# Altium schematic sheet Sheet1.SchDoc
size E
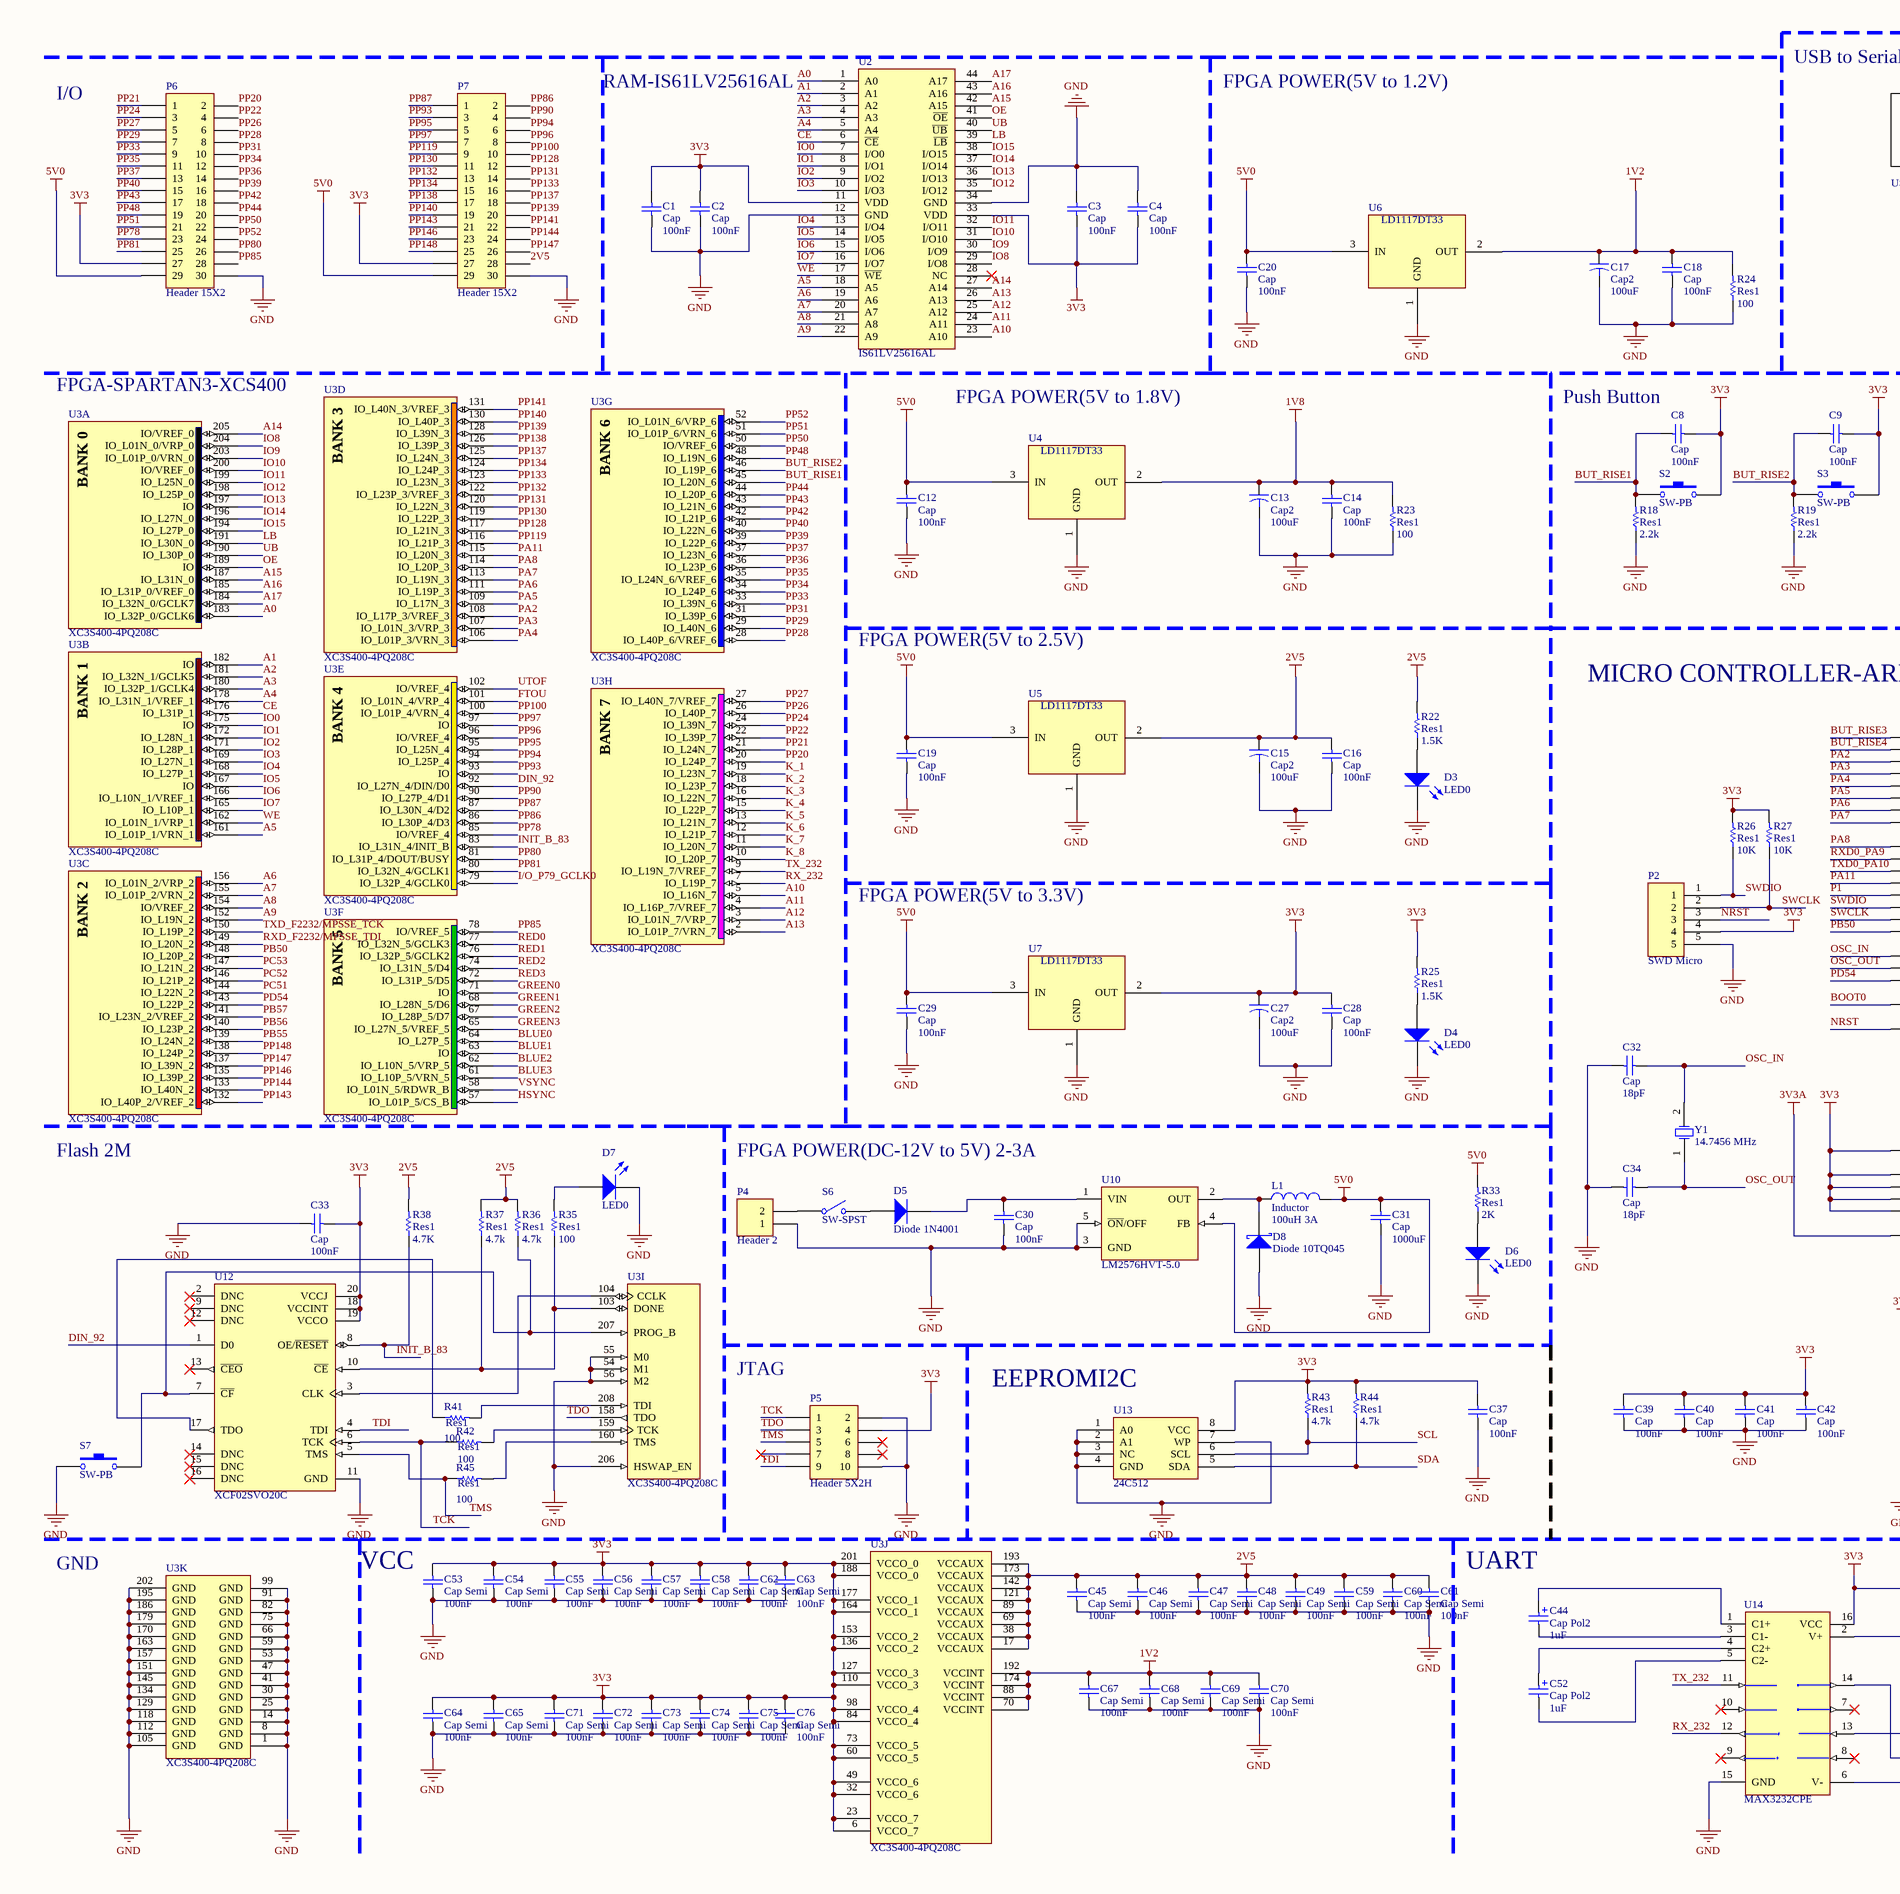
[diagram p0: Sheet1.SchDoc, left]
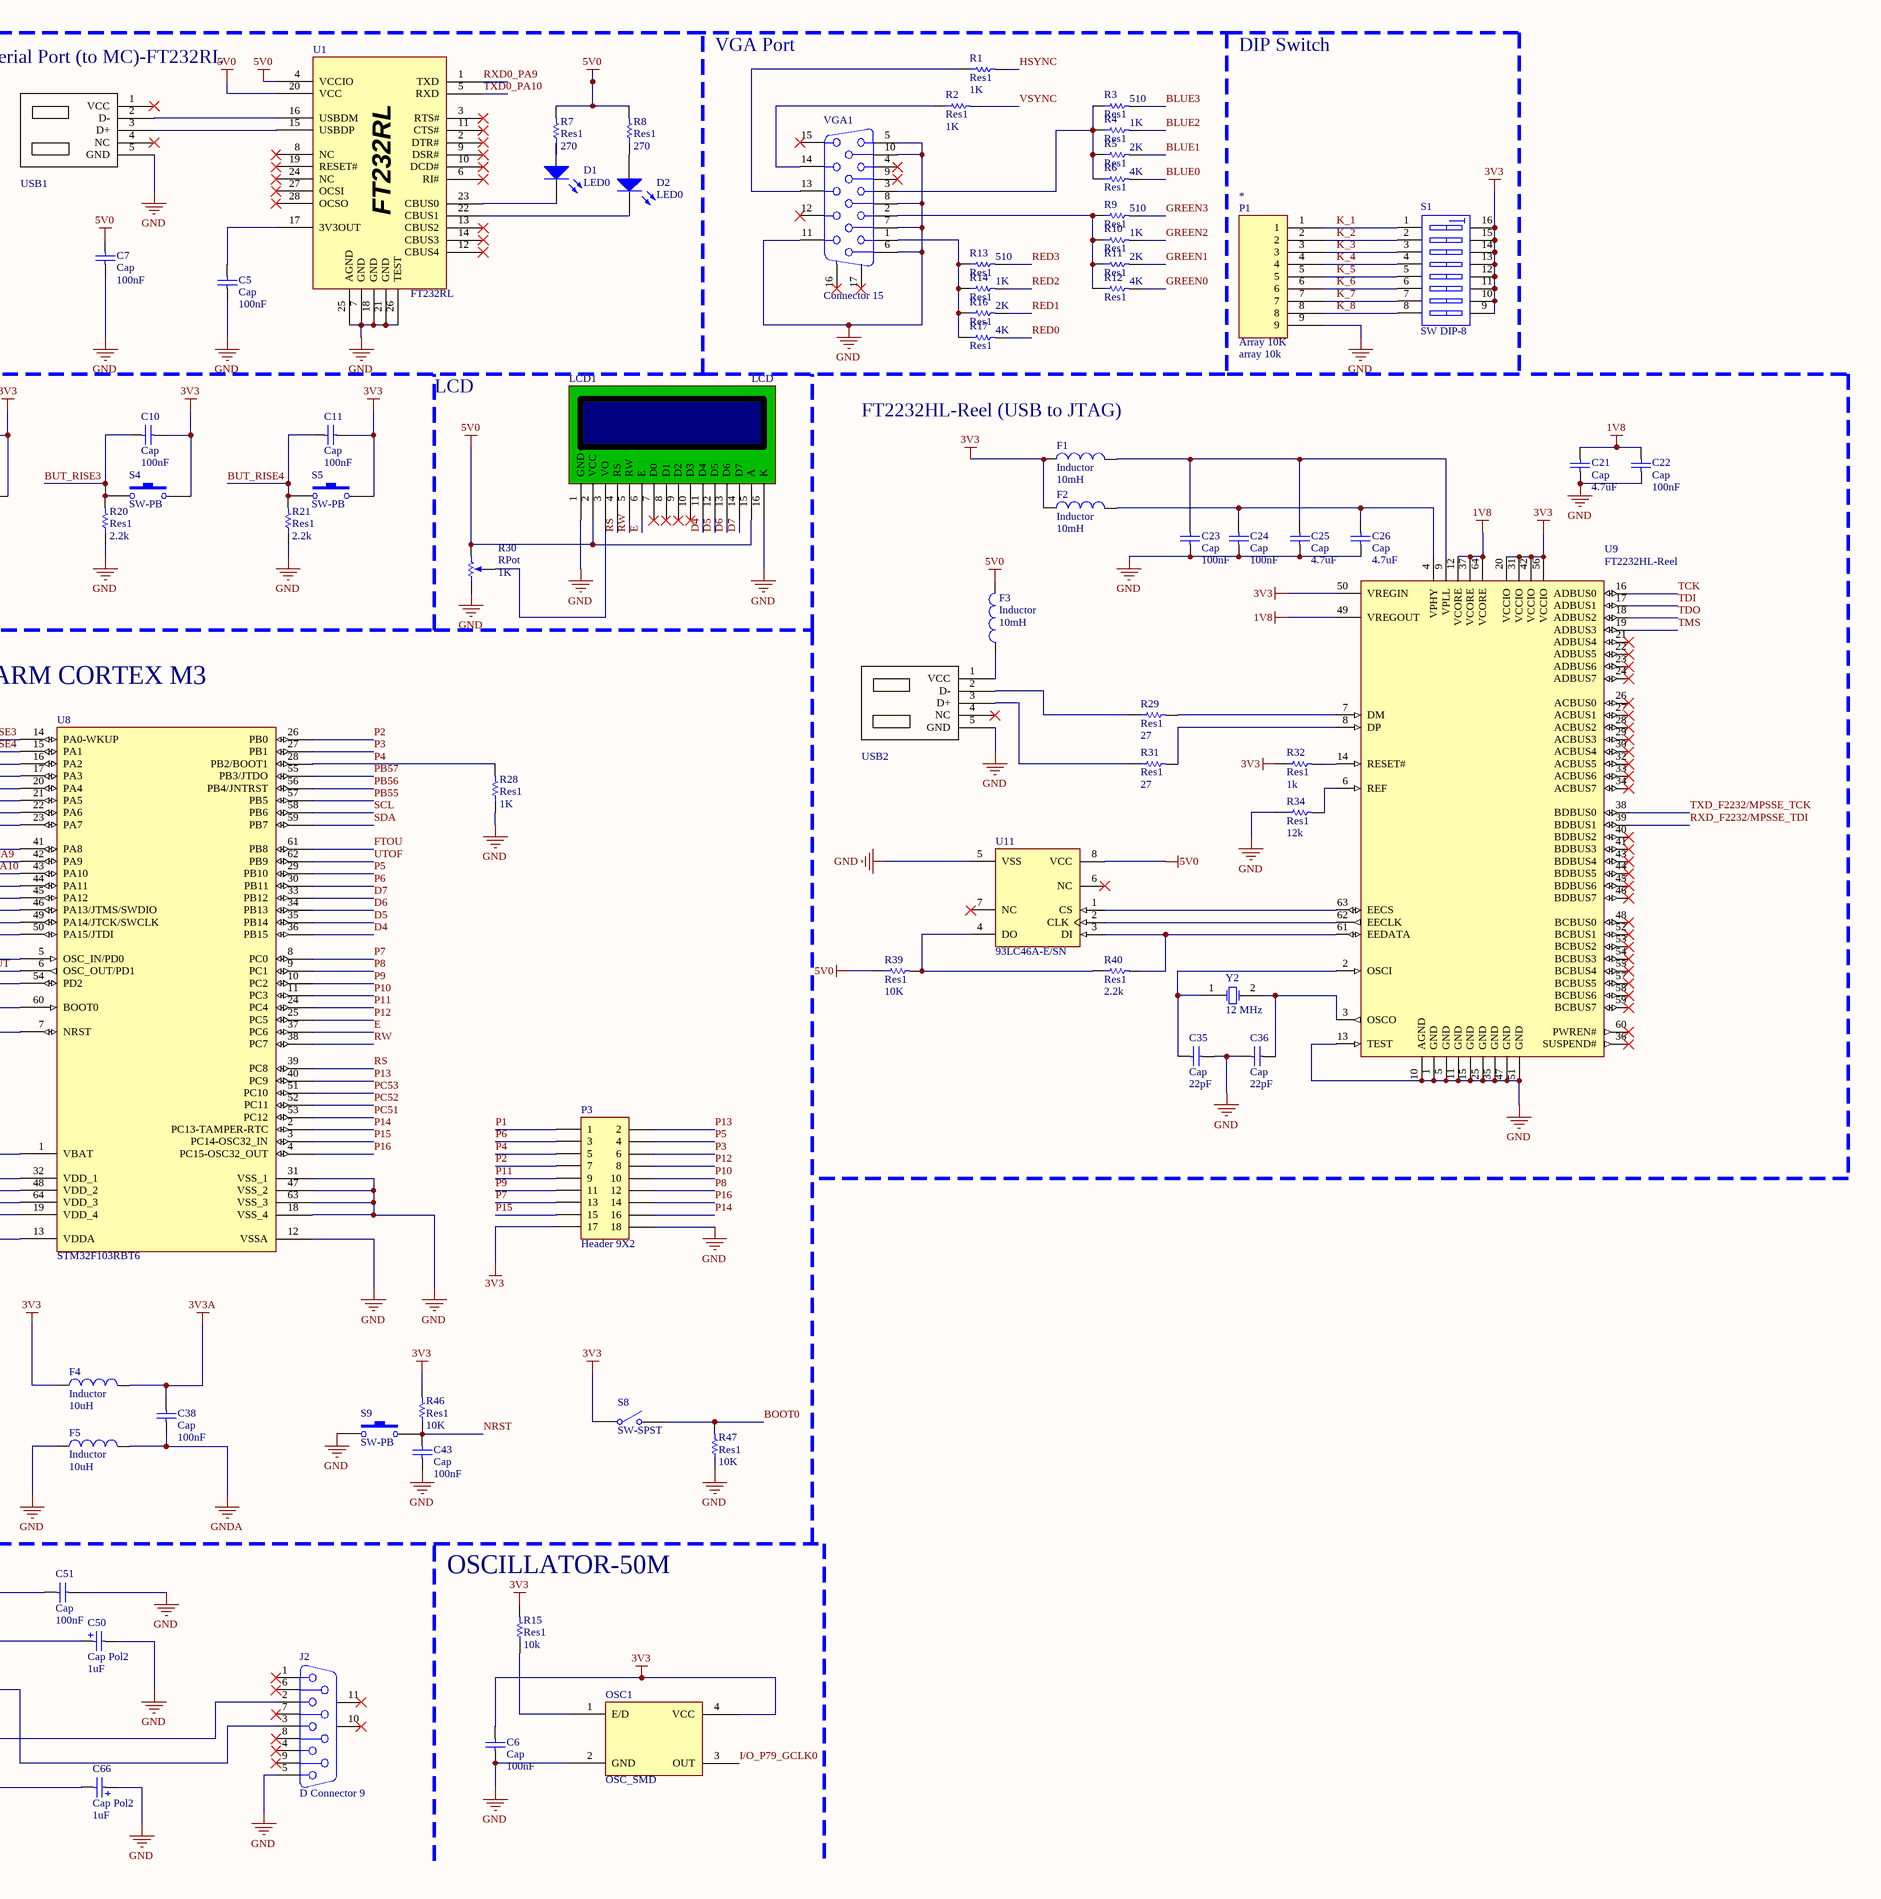
[diagram p1: Sheet1.SchDoc, right]

## Parts
*  array 10k  [Aray 9]
C1  Cap  value 100nF  [SMD_805]
C2  Cap  value 100nF  [SMD_805]
C3  Cap  value 100nF  [SMD_805]
C4  Cap  value 100nF  [SMD_805]
C5  Cap  value 100nF  [SMD_805]
C6  Cap  value 100nF  [SMD_805]
C7  Cap  value 100nF  [SMD_805]
C8  Cap  value 100nF  [SMD_805]
C9  Cap  value 100nF  [SMD_805]
C10  Cap  value 100nF  [SMD_805]
C11  Cap  value 100nF  [SMD_805]
C12  Cap  value 100nF  [SMD_805]
C13  Cap2  value 100uF  [C_B]
C14  Cap  value 100nF  [SMD_805]
C15  Cap2  value 100uF  [C_B]
C16  Cap  value 100nF  [SMD_805]
C17  Cap2  value 100uF  [C_B]
C18  Cap  value 100nF  [SMD_805]
C19  Cap  value 100nF  [SMD_805]
C20  Cap  value 100nF  [SMD_805]
C21  Cap  value 4.7uF  [SMD_805]
C22  Cap  value 100nF  [SMD_805]
C23  Cap  value 100nF  [SMD_805]
C24  Cap  value 100nF  [SMD_805]
C25  Cap  value 4.7uF  [SMD_805]
C26  Cap  value 4.7uF  [SMD_805]
C27  Cap2  value 100uF  [C_B]
C28  Cap  value 100nF  [SMD_805]
C29  Cap  value 100nF  [SMD_805]
C30  Cap  value 100nF  [C_CYL_SMD2]
C31  Cap  value 1000uF  [C_CYL_SMD]
C32  Cap  value 18pF  [SMD_805]
C33  Cap  value 100nF  [SMD_805]
C34  Cap  value 18pF  [SMD_805]
C35  Cap  value 22pF  [SMD_805]
C36  Cap  value 22pF  [SMD_805]
C37  Cap  value 100nF  [SMD_805]
C38  Cap  value 100nF  [SMD_805]
C39  Cap  value 100nF  [SMD_805]
C40  Cap  value 100nF  [SMD_805]
C41  Cap  value 100nF  [SMD_805]
C42  Cap  value 100nF  [SMD_805]
C43  Cap  value 100nF  [SMD_805]
C44  Cap Pol2  value 1uF  [C_B]
C45  Cap Semi  value 100nF  [SMD_805]
C46  Cap Semi  value 100nF  [SMD_805]
C47  Cap Semi  value 100nF  [SMD_805]
C48  Cap Semi  value 100nF  [SMD_805]
C49  Cap Semi  value 100nF  [SMD_805]
C50  Cap Pol2  value 1uF  [C_B]
C51  Cap  value 100nF  [SMD_805]
C52  Cap Pol2  value 1uF  [C_B]
C53  Cap Semi  value 100nF  [SMD_805]
C54  Cap Semi  value 100nF  [SMD_805]
C55  Cap Semi  value 100nF  [SMD_805]
C56  Cap Semi  value 100nF  [SMD_805]
C57  Cap Semi  value 100nF  [SMD_805]
C58  Cap Semi  value 100nF  [SMD_805]
C59  Cap Semi  value 100nF  [SMD_805]
C60  Cap Semi  value 100nF  [SMD_805]
C61  Cap Semi  value 100nF  [SMD_805]
C62  Cap Semi  value 100nF  [SMD_805]
C63  Cap Semi  value 100nF  [SMD_805]
C64  Cap Semi  value 100nF  [SMD_805]
C65  Cap Semi  value 100nF  [SMD_805]
C66  Cap Pol2  value 1uF  [C_B]
C67  Cap Semi  value 100nF  [SMD_805]
C68  Cap Semi  value 100nF  [SMD_805]
C69  Cap Semi  value 100nF  [SMD_805]
C70  Cap Semi  value 100nF  [SMD_805]
C71  Cap Semi  value 100nF  [SMD_805]
C72  Cap Semi  value 100nF  [SMD_805]
C73  Cap Semi  value 100nF  [SMD_805]
C74  Cap Semi  value 100nF  [SMD_805]
C75  Cap Semi  value 100nF  [SMD_805]
C76  Cap Semi  value 100nF  [SMD_805]
D1  LED0  [SMD_805]
D2  LED0  [SMD_805]
D3  LED0  [SMD_805]
D4  LED0  [SMD_805]
D5  Diode 1N4001  [TVS]
D6  LED0  [SMD_805]
D7  LED0  [SMD_805]
D8  Diode 10TQ045  [1N5822]
F1  Inductor  value 10mH  [SMD_805]
F2  Inductor  value 10mH  [SMD_805]
F3  Inductor  value 10mH  [SMD_805]
F4  Inductor  value 10uH  [SMD_805]
F5  Inductor  value 10uH  [SMD_805]
J2  D Connector 9  [COM_3d]
L1  Inductor  value 100uH 3A  [INDUC_SMD]
LCD1  LCD  [LCD2x16_3d]
OSC1  OSC_SMD  [OSC_SMD]
P2  P  [H5]  (value not drawn)
P3  Header 9X2  [HDR2X9]
P4  Header 2  [ADAP_JACK]
P5  Header 5X2H  [BOX2x5_3D]
P6  Header 15X2  [HDR2X15]
P7  Header 15X2  [HDR2X15]
R1  Res1  value 1K  [SMD_805]
R2  Res1  value 1K  [SMD_805]
R3  Res1  value 510  [SMD_805]
R4  Res1  value 1K  [SMD_805]
R5  Res1  value 2K  [SMD_805]
R6  Res1  value 4K  [SMD_805]
R7  Res1  value 270  [SMD_805]
R8  Res1  value 270  [SMD_805]
R9  Res1  value 510  [SMD_805]
R10  Res1  value 1K  [SMD_805]
R11  Res1  value 2K  [SMD_805]
R12  Res1  value 4K  [SMD_805]
R13  Res1  value 510  [SMD_805]
R14  Res1  value 1K  [SMD_805]
R15  Res1  value 10k  [SMD_805]
R16  Res1  value 2K  [SMD_805]
R17  Res1  value 4K  [SMD_805]
R18  Res1  value 2.2k  [SMD_805]
R19  Res1  value 2.2k  [SMD_805]
R20  Res1  value 2.2k  [SMD_805]
R21  Res1  value 2.2k  [SMD_805]
R22  Res1  value 1.5K  [SMD_805]
R23  Res1  value 100  [SMD_805]
R24  Res1  value 100  [SMD_805]
R25  Res1  value 1.5K  [SMD_805]
R26  Res1  value 10K  [SMD_805]
R27  Res1  value 10K  [SMD_805]
R28  Res1  value 1K  [SMD_805]
R29  Res1  value 27  [SMD_805]
R30  RPot  value 1K  [VR5]
R31  Res1  value 27  [SMD_805]
R32  Res1  value 1k  [SMD_805]
R33  Res1  value 2K  [SMD_805]
R34  Res1  value 12k  [SMD_805]
R35  Res1  value 100  [SMD_805]
R36  Res1  value 4.7k  [SMD_805]
R37  Res1  value 4.7k  [SMD_805]
R38  Res1  value 4.7K  [SMD_805]
R39  Res1  value 10K  [SMD_805]
R40  Res1  value 2.2k  [SMD_805]
R41  Res1  value 100  [SMD_805]
R42  Res1  value 100  [SMD_805]
R43  Res1  value 4.7k  [SMD_805]
R44  Res1  value 4.7k  [SMD_805]
R45  Res1  value 100  [SMD_805]
R46  Res1  value 10K  [SMD_805]
R47  Res1  value 10K  [SMD_805]
S1  SW DIP-8  [ARRAY_KEY8]
S2  SW-PB  [RES_B]
S3  SW-PB  [RES_B]
S4  SW-PB  [RES_B]
S5  SW-PB  [RES_B]
S6  SW-SPST  [KEY1]
S7  SW-PB  [SPST-2]
S8  SW-SPST  [SPST-2]
S9  SW-PB  [SPST-2]
U1  FT232RL  [SOP28]
U2  IS61LV25616AL  [SOP44]
U3  XC3S400-4PQ208C  [XC3S400_PQ208]  (parts A,B,C,D,E,F,G,H,I,J,K of 11)
U4  LD1117DT33  [SOT223]
U5  LD1117DT33  [SOT223]
U6  LD1117DT33  [SOT223]
U7  LD1117DT33  [SOT223]
U8  STM32F103RBT6  [PQFP64]
U9  FT2232HL-Reel  [LQFP64]
U10  LM2576HVT-5.0  [LM2576_SMD]
U11  93LC46A-E/SN  [SOIC127P600X175-8N]
U12  XCF02SVO20C  [XCF02S]
U13  24C512  [SOP8]
U14  MAX3232CPE  [SOP16]
USB1  MICRO_USB  [MINI_USB_NEW]  (value not drawn)
USB2  MICRO_USB  [MINI_USB_NEW]  (value not drawn)
VGA1  Connector 15  [VGA_PORT]
Y1  14.7456 MHz  [BC557]
Y2  12 MHz  [XTAL_SMD]

## Nets
1V2: C17.1 C18.2 C67.2 C68.2 C69.2 C70.2 R24.2 U3.70(VCCINT) U3.88(VCCINT) U3.174(VCCINT) U3.192(VCCINT) U6.2(OUT)
1V8: C13.1 C14.2 C21.2 C22.2 R23.2 U4.2(OUT) U9.12(VCORE) U9.37(VCORE) U9.49(VREGOUT) U9.64(VCORE)
2V5: C15.1 C16.2 C45.2 C46.2 C47.2 C48.2 C49.2 C59.2 C60.2 C61.2 P7.28 R22.2 R36.2 R37.2 R38.2 U3.17(VCCAUX) U3.38(VCCAUX) U3.69(VCCAUX) U3.89(VCCAUX) U3.121(VCCAUX) U3.142(VCCAUX) U3.173(VCCAUX) U3.193(VCCAUX) U5.2(OUT)
3V3: C1.2 C2.2 C3.1 C4.1 C6.2 C8.2 C9.2 C10.2 C11.2 C27.1 C28.2 C33.2 C37.2 C39.2 C40.2 C41.2 C42.2 C51.1 C53.2 C54.2 C55.2 C56.2 C57.2 C58.2 C62.2 C63.2 C64.2 C65.2 C71.2 C72.2 C73.2 C74.2 C75.2 C76.2 F1.1 F2.1 F4.1 OSC1.4(VCC) P2.4 P3.17 P5.4 P6.27 P7.27 R15.2 R25.2 R26.2 R27.2 R32.1 R43.2 R44.2 R46.2 S1.9(B8) S1.10(B7) S1.11(B6) S1.12(B5) S1.13(B4) S1.14(B3) S1.15(B2) S1.16(B1) S2.2 S3.2 S4.2 S5.2 S8.1(COMMON) U2.11(VDD) U2.33(VDD) U3.6(VCCO_7) U3.23(VCCO_7) U3.32(VCCO_6) U3.49(VCCO_6) U3.60(VCCO_5) U3.73(VCCO_5) U3.84(VCCO_4) U3.98(VCCO_4) U3.110(VCCO_3) U3.127(VCCO_3) U3.136(VCCO_2) U3.153(VCCO_2) U3.164(VCCO_1) U3.177(VCCO_1) U3.188(VCCO_0) U3.201(VCCO_0) U7.2(OUT) U8.1(VBAT) U8.19(VDD_4) U8.32(VDD_1) U8.48(VDD_2) U8.64(VDD_3) U9.20(VCCIO) U9.31(VCCIO) U9.42(VCCIO) U9.50(VREGIN) U9.56(VCCIO) U12.18(VCCINT) U12.19(VCCO) U12.20(VCCJ) U13.8(VCC) U14.16(VCC)
3V3A: C38.2 F4.2 U8.13(VDDA)
5V0: C7.2 C12.2 C19.2 C20.2 C29.2 C31.2 F3.2 L1.2 LCD1.2(VCC) LCD1.15(A) P6.29 P7.29 R7.2 R8.2 R30.2(BOT) R33.2 R39.1 U1.4(VCCIO) U1.20(VCC) U4.3(IN) U5.3(IN) U6.3(IN) U7.3(IN) U10.4(FB) U11.8(VCC)
GND: *.9 C1.1 C2.1 C3.2 C4.2 C5.1 C6.1 C7.1 C12.1 C13.2 C14.1 C15.2 C16.1 C17.2 C18.1 C19.1 C20.1 C21.1 C22.1 C23.1 C24.1 C25.1 C26.1 C27.2 C28.1 C29.1 C30.1 C31.1 C32.1 C33.1 C34.1 C35.1 C36.2 C37.1 C39.1 C40.1 C41.1 C42.1 C43.1 C45.1 C46.1 C47.1 C48.1 C49.1 C50.2 C51.2 C53.1 C54.1 C55.1 C56.1 C57.1 C58.1 C59.1 C60.1 C61.1 C62.1 C63.1 C64.1 C65.1 C66.1 C67.1 C68.1 C69.1 C70.1 C71.1 C72.1 C73.1 C74.1 C75.1 C76.1 D3.2(K) D4.2(K) D6.2(K) D7.2(K) D8.3(A) F5.1 J2.5 LCD1.1(GND) LCD1.16(K) OSC1.2(GND) P2.5 P3.18 P4.1 P5.2 P5.10 P6.30 P7.30 R18.1 R19.1 R20.1 R21.1 R23.1 R24.1 R28.1 R30.1(TOP) R34.1 R47.1 S7.1 S9.1 U1.7(GND) U1.18(GND) U1.21(GND) U1.25(AGND) U1.26(TEST) U2.12(GND) U2.34(GND) U3.1(GND) U3.8(GND) U3.14(GND) U3.25(GND) U3.30(GND) U3.41(GND) U3.47(GND) U3.53(GND) U3.54(M1) U3.55(M0) U3.56(M2) U3.59(GND) U3.66(GND) U3.75(GND) U3.82(GND) U3.91(GND) U3.99(GND) U3.105(GND) U3.112(GND) U3.118(GND) U3.129(GND) U3.134(GND) U3.145(GND) U3.151(GND) U3.157(GND) U3.163(GND) U3.170(GND) U3.179(GND) U3.186(GND) U3.195(GND) U3.202(GND) U3.206(HSWAP_EN) U4.1(GND) U5.1(GND) U6.1(GND) U7.1(GND) U8.12(VSSA) U8.18(VSS_4) U8.31(VSS_1) U8.47(VSS_2) U8.63(VSS_3) U9.1(GND) U9.5(GND) U9.10(AGND) U9.11(GND) U9.13(TEST) U9.15(GND) U9.25(GND) U9.35(GND) U9.47(GND) U9.51(GND) U10.3(GND) U10.5(~{ON}/OFF) U11.5(VSS) U12.11(GND) U13.1(A0) U13.2(A1) U13.3(NC) U13.4(GND) U13.7(WP) U14.15(GND) USB1.5(GND) USB2.5(GND) VGA1.5 VGA1.6 VGA1.7 VGA1.8 VGA1.10 VGA1.11
GNDA: C38.1 F5.2
A0: U2.1(A0) U3.183(IO_L32P_0/GCLK6)
A1: U2.2(A1) U3.182(IO)
A2: U2.3(A2) U3.181(IO_L32N_1/GCLK5)
A3: U2.4(A3) U3.180(IO_L32P_1/GCLK4)
A4: U2.5(A4) U3.178(IO_L31N_1/VREF_1)
A5: U2.18(A5) U3.161(IO_L01P_1/VRN_1)
A6: U2.19(A6) U3.156(IO_L01N_2/VRP_2)
A7: U2.20(A7) U3.155(IO_L01P_2/VRN_2)
A8: U2.21(A8) U3.154(IO/VREF_2)
A9: U2.22(A9) U3.152(IO_L19N_2)
A10: U2.23(A10) U3.5(IO_L16N_7)
A11: U2.24(A11) U3.4(IO_L16P_7/VREF_7)
A12: U2.25(A12) U3.3(IO_L01N_7/VRP_7)
A13: U2.26(A13) U3.2(IO_L01P_7/VRN_7)
A14: U2.27(A14) U3.205(IO/VREF_0)
A15: U2.42(A15) U3.187(IO_L31N_0)
A16: U2.43(A16) U3.185(IO_L31P_0/VREF_0)
A17: U2.44(A17) U3.184(IO_L32N_0/GCLK7)
BLUE0: R6.2 U3.64(IO_L27P_5)
BLUE1: R5.2 U3.63(IO)
BLUE2: R4.2 U3.62(IO_L10N_5/VRP_5)
BLUE3: R3.2 U3.61(IO_L10P_5/VRN_5)
BOOT0: R47.2 S8.2(NO) U8.60(BOOT0)
BUT_RISE1: C8.1 R18.2 S2.1 U3.45(IO_L20N_6)
BUT_RISE2: C9.1 R19.2 S3.1 U3.46(IO_L19P_6)
BUT_RISE3: C10.1 R20.2 S4.1 U8.14(PA0-WKUP)
BUT_RISE4: C11.1 R21.2 S5.1 U8.15(PA1)
CE: U2.6(~{CE}) U3.176(IO_L31P_1)
D4: LCD1.11(D4) U8.36(PB15)
D5: LCD1.12(D5) U8.35(PB14)
D6: LCD1.13(D6) U8.34(PB13)
D7: LCD1.14(D7) U8.33(PB12)
DIN_92: U3.92(IO_L27N_4/DIN/D0) U12.1(D0)
E: LCD1.6(E) U8.37(PC6)
FTOU: U3.101(IO_L01N_4/VRP_4) U8.61(PB8)
GREEN0: R12.2 U3.71(IO)
GREEN1: R11.2 U3.68(IO_L28N_5/D6)
GREEN2: R10.2 U3.67(IO_L28P_5/D7)
GREEN3: R9.2 U3.65(IO_L27N_5/VREF_5)
HSYNC: R1.2 U3.57(IO_L01P_5/CS_B)
I/O_P79_GCLK0: OSC1.3(OUT) U3.79(IO_L32P_4/GCLK0)
INIT_B_83: R38.1 U3.83(IO_L31N_4/INIT_B) U12.8(OE/~{RESET})
IO0: U2.7(I/O0) U3.175(IO)
IO1: U2.8(I/O1) U3.172(IO_L28N_1)
IO2: U2.9(I/O2) U3.171(IO_L28P_1)
IO3: U2.10(I/O3) U3.169(IO_L27N_1)
IO4: U2.13(I/O4) U3.168(IO_L27P_1)
IO5: U2.14(I/O5) U3.167(IO)
IO6: U2.15(I/O6) U3.166(IO_L10N_1/VREF_1)
IO7: U2.16(I/O7) U3.165(IO_L10P_1)
IO8: U2.29(I/O8) U3.204(IO_L01N_0/VRP_0)
IO9: U2.30(I/O9) U3.203(IO_L01P_0/VRN_0)
IO10: U2.31(I/O10) U3.200(IO/VREF_0)
IO11: U2.32(I/O11) U3.199(IO_L25N_0)
IO12: U2.35(I/O12) U3.198(IO_L25P_0)
IO13: U2.36(I/O13) U3.197(IO)
IO14: U2.37(I/O14) U3.196(IO_L27N_0)
IO15: U2.38(I/O15) U3.194(IO_L27P_0)
K_1: *.1 S1.1(A1) U3.19(IO_L23N_7)
K_2: *.2 S1.2(A2) U3.18(IO_L23P_7)
K_3: *.3 S1.3(A3) U3.16(IO_L22N_7)
K_4: *.4 S1.4(A4) U3.15(IO_L22P_7)
K_5: *.5 S1.5(A5) U3.13(IO_L21N_7)
K_6: *.6 S1.6(A6) U3.12(IO_L21P_7)
K_7: *.7 S1.7(A7) U3.11(IO_L20N_7)
K_8: *.8 S1.8(A8) U3.10(IO_L20P_7)
LB: U2.39(~{LB}) U3.191(IO_L30N_0)
NRST: C43.2 P2.3 R46.1 S9.2 U8.7(NRST)
OE: U2.41(~{OE}) U3.189(IO)
OSC_IN: C32.2 U8.5(OSC_IN/PD0) Y1.2(OSC2)
OSC_OUT: C34.2 U8.6(OSC_OUT/PD1) Y1.1(OSC1)
P1: P3.1 U8.45(PA12)
P2: P3.7 U8.26(PB0)
P3: P3.6 U8.27(PB1)
P4: P3.5 R28.2 U8.28(PB2/BOOT1)
P5: P3.4 U8.29(PB10)
P6: P3.3 U8.30(PB11)
P7: P3.13 U8.8(PC0)
P8: P3.12 U8.9(PC1)
P9: P3.11 U8.10(PC2)
P10: P3.10 U8.11(PC3)
P11: P3.9 U8.24(PC4)
P12: P3.8 U8.25(PC5)
P13: P3.2 U8.40(PC9)
P14: P3.16 U8.2(PC13-TAMPER-RTC)
P15: P3.15 U8.3(PC14-OSC32_IN)
P16: P3.14 U8.4(PC15-OSC32_OUT)
PA2: U3.108(IO_L17P_3/VREF_3) U8.16(PA2)
PA3: U3.107(IO_L01N_3/VRP_3) U8.17(PA3)
PA4: U3.106(IO_L01P_3/VRN_3) U8.20(PA4)
PA5: U3.109(IO_L17N_3) U8.21(PA5)
PA6: U3.111(IO_L19P_3) U8.22(PA6)
PA7: U3.113(IO_L19N_3) U8.23(PA7)
PA8: U3.114(IO_L20P_3) U8.41(PA8)
PA11: U3.115(IO_L20N_3) U8.44(PA11)
PB50: U3.148(IO_L20P_2) U8.50(PA15/JTDI)
PB55: U3.139(IO_L24N_2) U8.57(PB5)
PB56: U3.140(IO_L23P_2) U8.56(PB4/JNTRST)
PB57: U3.141(IO_L23N_2/VREF_2) U8.55(PB3/JTDO)
PC51: U3.144(IO_L22N_2) U8.53(PC12)
PC52: U3.146(IO_L21P_2) U8.52(PC11)
PC53: U3.147(IO_L21N_2) U8.51(PC10)
PD54: U3.143(IO_L22P_2) U8.54(PD2)
PP20: P6.2 U3.20(IO_L24P_7)
PP21: P6.1 U3.21(IO_L24N_7)
PP22: P6.4 U3.22(IO_L39P_7)
PP24: P6.3 U3.24(IO_L39N_7)
PP26: P6.6 U3.26(IO_L40P_7)
PP27: P6.5 U3.27(IO_L40N_7/VREF_7)
PP28: P6.8 U3.28(IO_L40P_6/VREF_6)
PP29: P6.7 U3.29(IO_L40N_6)
PP31: P6.10 U3.31(IO_L39P_6)
PP33: P6.9 U3.33(IO_L39N_6)
PP34: P6.12 U3.34(IO_L24P_6)
PP35: P6.11 U3.35(IO_L24N_6/VREF_6)
PP36: P6.14 U3.36(IO_L23P_6)
PP37: P6.13 U3.37(IO_L23N_6)
PP39: P6.16 U3.39(IO_L22P_6)
PP40: P6.15 U3.40(IO_L22N_6)
PP42: P6.18 U3.42(IO_L21P_6)
PP43: P6.17 U3.43(IO_L21N_6)
PP44: P6.20 U3.44(IO_L20P_6)
PP48: P6.19 U3.48(IO_L19N_6)
PP50: P6.22 U3.50(IO/VREF_6)
PP51: P6.21 U3.51(IO_L01P_6/VRN_6)
PP52: P6.24 U3.52(IO_L01N_6/VRP_6)
PP78: P6.23 U3.85(IO/VREF_4)
PP80: P6.26 U3.81(IO_L31P_4/DOUT/BUSY)
PP81: P6.25 U3.80(IO_L32N_4/GCLK1)
PP85: P6.28 U3.78(IO/VREF_5)
PP86: P7.2 U3.86(IO_L30P_4/D3)
PP87: P7.1 U3.87(IO_L30N_4/D2)
PP90: P7.4 U3.90(IO_L27P_4/D1)
PP93: P7.3 U3.93(IO)
PP94: P7.6 U3.94(IO_L25P_4)
PP95: P7.5 U3.95(IO_L25N_4)
PP96: P7.8 U3.96(IO/VREF_4)
PP97: P7.7 U3.97(IO)
PP100: P7.10 U3.100(IO_L01P_4/VRN_4)
PP119: P7.9 U3.116(IO_L21P_3)
PP128: P7.12 U3.117(IO_L21N_3)
PP130: P7.11 U3.119(IO_L22P_3)
PP131: P7.14 U3.120(IO_L22N_3)
PP132: P7.13 U3.122(IO_L23P_3/VREF_3)
PP133: P7.16 U3.123(IO_L23N_3)
PP134: P7.15 U3.124(IO_L24P_3)
PP137: P7.18 U3.125(IO_L24N_3)
PP138: P7.17 U3.126(IO_L39P_3)
PP139: P7.20 U3.128(IO_L39N_3)
PP140: P7.19 U3.130(IO_L40P_3)
PP141: P7.22 U3.131(IO_L40N_3/VREF_3)
PP143: P7.21 U3.132(IO_L40P_2/VREF_2)
PP144: P7.24 U3.133(IO_L40N_2)
PP146: P7.23 U3.135(IO_L39P_2)
PP147: P7.26 U3.137(IO_L39N_2)
PP148: P7.25 U3.138(IO_L24P_2)
RED0: R17.2 U3.77(IO_L32N_5/GCLK3)
RED1: R16.2 U3.76(IO_L32P_5/GCLK2)
RED2: R14.2 U3.74(IO_L31N_5/D4)
RED3: R13.2 U3.72(IO_L31P_5/D5)
RS: LCD1.4(RS) U8.39(PC8)
RW: LCD1.5(RW) U8.38(PC7)
RX_232: U3.7(IO_L19P_7) U14.12(R1OUT)
RXD0_PA9: U1.1(TXD) U8.42(PA9)
RXD_F2232/MPSSE_TDI: U3.149(IO_L20N_2) U9.39(BDBUS1)
SCL: R43.1 U8.58(PB6) U13.6(SCL)
SDA: R44.1 U8.59(PB7) U13.5(SDA)
SWCLK: P2.2 R27.1 U8.49(PA14/JTCK/SWCLK)
SWDIO: P2.1 R26.1 U8.46(PA13/JTMS/SWDIO)
TCK: P5.1 R42.1 U9.16(ADBUS0) U12.6(TCK)
TDI: P5.9 U9.17(ADBUS1) U12.4(TDI)
TDO: P5.3 U3.158(TDO) U9.18(ADBUS2)
TMS: P5.5 R45.1 U9.19(ADBUS3) U12.5(TMS)
TX_232: U3.9(IO_L19N_7/VREF_7) U14.11(T1IN)
TXD0_PA10: U1.5(RXD) U8.43(PA10)
TXD_F2232/MPSSE_TCK: U3.150(IO_L19P_2) U9.38(BDBUS0)
UB: U2.40(~{UB}) U3.190(IO_L30P_0)
UTOF: U3.102(IO/VREF_4) U8.62(PB9)
VSYNC: R2.2 U3.58(IO_L01N_5/RDWR_B)
WE: U2.17(~{WE}) U3.162(IO_L01N_1/VRP_1)
NetC5_2: C5.2 U1.17(3V3OUT)
NetC23_2: C23.2 C25.2 F1.2 U9.9(VPLL)
NetC24_2: C24.2 C26.2 F2.2 U9.4(VPHY)
NetC30_2: C30.2 D5.2(K) U10.1(VIN)
NetC35_2: C35.2 U9.2(OSCI) Y2.1(OSC1)
NetC36_1: C36.1 U9.3(OSCO) Y2.2(OSC2)
NetC44_1: C44.1 U14.1(C1+)
NetC44_2: C44.2 U14.3(C1-)
NetC50_1: C50.1 U14.2(V+)
NetC52_1: C52.1 U14.4(C2+)
NetC52_2: C52.2 U14.5(C2-)
NetC66_2: C66.2 U14.6(V-)
NetD1_1: D1.1(A) R7.1
NetD1_2: D1.2(K) U1.23(CBUS0)
NetD2_1: D2.1(A) R8.1
NetD2_2: D2.2(K) U1.22(CBUS1)
NetD3_1: D3.1(A) R22.1
NetD4_1: D4.1(A) R25.1
NetD5_1: D5.1(A) S6.2(NO)
NetD6_1: D6.1(A) R33.1
NetD7_1: D7.1(A) R35.2
NetD8_1: D8.1(K) L1.1 U10.2(OUT)
NetF3_1: F3.1 USB2.1(VCC)
NetJ2_2: J2.2 U14.13(R1IN)
NetJ2_3: J2.3 U14.14(T1OUT)
NetLCD1_3: LCD1.3(VO) R30.3(TAP)
NetOSC1_1: OSC1.1(E/D) R15.1
NetP4_2: P4.2 S6.1(COMMON)
NetR1_1: R1.1 VGA1.13
NetR2_1: R2.1 VGA1.14
NetR3_1: R3.1 R4.1 R5.1 R6.1 VGA1.3
NetR9_1: R9.1 R10.1 R11.1 R12.1 VGA1.2
NetR13_1: R13.1 R14.1 R16.1 R17.1 VGA1.1
NetR29_1: R29.1 USB2.2(D-)
NetR29_2: R29.2 U9.7(DM)
NetR31_1: R31.1 USB2.3(D+)
NetR31_2: R31.2 U9.8(DP)
NetR32_2: R32.2 U9.14(RESET#)
NetR34_2: R34.2 U9.6(REF)
NetR35_1: R35.1 R37.1 U3.103(DONE) U12.10(~{CE})
NetR36_1: R36.1 S7.2 U3.207(PROG_B) U12.7(~{CF})
NetR39_2: R39.2 R40.1 U11.4(DO)
NetR40_2: R40.2 U9.61(EEDATA) U11.3(DI)
NetR41_1: R41.1 U12.17(TDO)
NetR41_2: R41.2 U3.208(TDI)
NetR42_2: R42.2 U3.159(TCK)
NetR45_2: R45.2 U3.160(TMS)
NetU1_15: U1.15(USBDP) USB1.3(D+)
NetU1_16: U1.16(USBDM) USB1.2(D-)
NetU3_104: U3.104(CCLK) U12.3(CLK)
NetU9_62: U9.62(EECLK) U11.2(CLK)
NetU9_63: U9.63(EECS) U11.1(CS)

Not connected (* = marked no-connect by the designer): J2 1* 4* 6* 7* 8* 9* 10(MH1)* 11(MH2)*; LCD1 7(D0)* 8(D1)* 9(D2)* 10(D3)*; P5 6* 7* 8*; U1 2(DTR#)* 3(RTS#)* 6(RI#)* 8(NC)* 9(DSR#)* 10(DCD#)* 11(CTS#)* 12(CBUS4)* 13(CBUS2)* 14(CBUS3)* 19(RESET#)* 24(NC)* 27(OCSI)* 28(OCSO)*; U2 28(NC)*; U9 21(ADBUS4)* 22(ADBUS5)* 23(ADBUS6)* 24(ADBUS7)* 26(ACBUS0)* 27(ACBUS1)* 28(ACBUS2)* 29(ACBUS3)* 30(ACBUS4)* 32(ACBUS5)* 33(ACBUS6)* 34(ACBUS7)* 36(SUSPEND#)* 40(BDBUS2)* 41(BDBUS3)* 43(BDBUS4)* 44(BDBUS5)* 45(BDBUS6)* 46(BDBUS7)* 48(BCBUS0)* 52(BCBUS1)* 53(BCBUS2)* 54(BCBUS3)* 55(BCBUS4)* 57(BCBUS5)* 58(BCBUS6)* 59(BCBUS7)* 60(PWREN#)*; U11 6(NC)* 7(NC)*; U12 2(DNC)* 9(DNC)* 12(DNC)* 13(~{CEO})* 14(DNC)* 15(DNC)* 16(DNC)*; U14 7(T2OUT)* 8(R2IN)* 9(R2OUT)* 10(T2IN)*; USB1 1(VCC)* 4(NC)*; USB2 4(NC)*; VGA1 4* 9* 12* 15* 16(MH1)* 17(MH2)*

## Notes on the sheet
- I/O
- RAM-IS61LV25616AL
- FPGA POWER(5V to 1.2V)
- USB to Serial Port (to MC)-FT232RL
- VGA Port
- DIP Switch
- (near U3) FPGA-SPARTAN3-XCS400
- FPGA POWER(5V to 1.8V)
- (near C8) Push Button
- LCD
- (near F1) FT2232HL-Reel (USB to JTAG)
- FPGA POWER(5V to 2.5V)
- MICRO CONTROLLER-ARM CORTEX M3
- FPGA POWER(5V to 3.3V)
- Flash 2M
- FPGA POWER(DC-12V to 5V) 2-3A
- JTAG
- (near U13) EEPROMI2C
- GND
- (near C53) VCC
- UART
- (near R15) OSCILLATOR-50M
- (in symbol array 10k) P1; Array 10K
- (in symbol Component_1) SWD Micro
- (in symbol XC3S400-4PQ208C, part A) BANK 0
- (in symbol XC3S400-4PQ208C, part B) BANK 1
- (in symbol XC3S400-4PQ208C, part C) BANK 2
- (in symbol XC3S400-4PQ208C, part D) BANK 3
- (in symbol XC3S400-4PQ208C, part E) BANK 4
- (in symbol XC3S400-4PQ208C, part F) BANK 5
- (in symbol XC3S400-4PQ208C, part G) BANK 6
- (in symbol XC3S400-4PQ208C, part H) BANK 7

## Library data of the parts
C1-C12 C14 C16 C18-C26 C28-C43 C51 = Cap: Capacitor; Published: 8-Jun-2000; LatestRevisionDate: 17-Jul-2002; LatestRevisionNote: Re-released for DXP Platform.; PackageReference: RAD-0.3; Publisher: Altium Limited; PackageDescription: Radial Cap, Thru-Hole; 2 Leads; 0.3 in Pin Spacing
C13 C15 C17 C27 = Cap2: Capacitor; Published: 23-Sep-2002; PackageReference: CAPR5-4X5; Publisher: Altium Limited; PackageDescription: Capacitor; 2 Leads
C44 C50 C52 C66 = Cap Pol2: Polarized Capacitor (Axial); Published: 8-Jun-2000; LatestRevisionDate: 17-Jul-2002; LatestRevisionNote: Re-released for DXP Platform.; PackageReference: POLAR0.8; Publisher: Altium Limited; PackageDescription: Polarized Capacitor; 2 Leads
C45-C49 C53-C65 C67-C76 = Cap Semi: Capacitor (Semiconductor SIM Model); Published: 8-Jun-2000; LatestRevisionDate: 29-May-2009; LatestRevisionNote: IPC-7351 Footprint Added.; PackageReference: C1206; Publisher: Altium Limited; PackageDescription: Chip Capacitor
D1-D4 D6 D7 = LED0: Typical INFRARED GaAs LED; Published: 8-Jun-2000; LatestRevisionDate: 08-Jul-2005; LatestRevisionNote: Mech Layer 1 removed.; PackageReference: LED-0; Publisher: Altium Limited; PackageDescription: LED; 2 Leads
D5 = Diode 1N4001: 1 Amp General Purpose Rectifier; Published: 8-Jun-2000; LatestRevisionDate: 17-Jul-2002; LatestRevisionNote: Re-released for DXP Platform.; DatasheetVersion: 1998; PackageVersion: Aug-1999; PackageReference: DO-41; Publisher: Altium Limited; PackageDescription: Diode, Axial; Body 5.2 x 2.7 mm (LxDia. max), Lead Dia. 0.86 mm (max); Code_JEDEC: DO-204-AL; ComponentLink1Description: Manufacturer Link; ComponentLink1URL: http://www.fairchildsemi.com/; ComponentLink2Description: Datasheet; ComponentLink2URL: http://www.fairchildsemi.com/ds/1N%2F1N4001.pdf
D8 = Diode 10TQ045: Schottky Rectifier; Note: Terminal 2 is the TAB and is electrically connected to the cathode; Published: 8-Jun-2000; LatestRevisionDate: 17-Jul-2002; LatestRevisionNote: Re-released for DXP Platform.; DatasheetVersion: PD-2.057B; PackageVersion: Feb-1998; PackageReference: TO-220AC; Publisher: Altium Limited; PackageDescription: TO, Thru-Hole, Vertical, Heatsink Mounted; 3 In-Line Leads (1 Absent); Pitch 2.54 mm; ComponentLink1Description: Manufacturer Link; ComponentLink1URL: http://www.irf.com/; ComponentLink2Description: Datasheet; ComponentLink2URL: http://www.irf.com/product-info/datasheets/data/10tq.pdf
F1-F5 L1 = Inductor: Code_IEC: 1005; Published: 8-Jun-2000; LatestRevisionDate: 29-May-2009; LatestRevisionNote: IPC-7351 Footprint Added.; PackageReference: 0402-A; Publisher: Altium Limited; PackageDescription: Chip Inductor; Code_JEITA: 0402
J2 = D Connector 9: Receptacle Assembly, 9 Position, Right Angle; PackageDocument: O; Positions: 9; Published: 15-Jun-2001; LatestRevisionDate: 17-Jul-2002; LatestRevisionNote: Re-released for DXP Platform.; DatasheetDocument: 1-Sep-1999; PackageReference: 788750; Publisher: Altium Limited; Orientation: Right Angle; Gender: Receptacle
OSC1 = Component_1: Designer:: Mohammad Ansari
P2 U4-U7 = Component_1
P3 = Header 9X2: Header, 9-Pin, Dual row; LatestRevisionDate: 17-Jul-2002; LatestRevisionNote: Re-released for DXP Platform.; Publisher: Altium Limited
P4 = Header 2: Header, 2-Pin; LatestRevisionDate: 17-Jul-2002; LatestRevisionNote: Re-released for DXP Platform.; Publisher: Altium Limited
P5 = Header 5X2H: Header, 5-Pin, Dual row, Right Angle; LatestRevisionDate: 17-Jul-2002; LatestRevisionNote: Re-released for DXP Platform.; Publisher: Altium Limited
P6 P7 = Header 15X2: Header, 15-Pin, Dual row; LatestRevisionDate: 17-Jul-2002; LatestRevisionNote: Re-released for DXP Platform.; Publisher: Altium Limited
R1-R29 R31-R47 = Res1: Resistor; Published: 8-Jun-2000; LatestRevisionDate: 17-Jul-2002; LatestRevisionNote: Re-released for DXP Platform.; PackageReference: AXIAL-0.3; Publisher: Altium Limited; PackageDescription: Axial Device, Thru-Hole; 2 Leads; 0.3 in Pin Spacing
R30 = RPot: Potentiometer; Sim Note: Enter the Resistance value and the set point into parameter fields.; Set Position: 0.5; Published: 8-Jun-2000; LatestRevisionDate: 17-Jul-2002; LatestRevisionNote: Re-released for DXP Platform.; PackageReference: VR5; Publisher: Altium Limited; PackageDescription: Variable Resistor, Thru-Hole; 3 Leads
S1 = SW DIP-8: DIP Switch, 8 Position, SPST; Published: 24-Mar-1999; LatestRevisionDate: 17-Jul-2002; LatestRevisionNote: Re-released for DXP Platform.; PackageReference: DIP_SW_8WAY_SMD; Publisher: Altium Limited; PackageDescription: DIP Switch; 16 Leads
S2-S5 S7 S9 = SW-PB: Switch; Published: 24-Mar-1999; LatestRevisionDate: 17-Jul-2002; LatestRevisionNote: Re-released for DXP Platform.; PackageReference: SPST-2; Publisher: Altium Limited; PackageDescription: Switch; 2 Leads
S6 S8 = SW-SPST: Single-Pole, Single-Throw Switch; Published: 24-Mar-1999; LatestRevisionDate: 17-Jul-2002; LatestRevisionNote: Re-released for DXP Platform.; PackageReference: SPST-2; Publisher: Altium Limited; PackageDescription: Switch; 2 Leads
U3 = XC3S400-4PQ208C: Spartan-3 1.2V FPGA, 141 User I/Os, 208-Pin PQFP, Standard Performance, Commercial Grade; Ordering Information: Additional code may have to be appended for different mask revision devices.; FirstPublished: 17-Sep-2003; LatestRevisionDate: 05-Mar-2009; LatestRevisionNote: Updated to datasheet version 2.4 Jun-2008.; DatasheetVersion: ver2.4, Jun-2008; PackageVersion: ver1.2, Jun-2004; PackageReference: PQ208; Publisher: Altium Limited; PackageDescription: 208-Pin Plastic Quad Flat Pack (PQ208); Supplier 1: Digi-Key; Supplier Part Number 1: XC3S400-4PQ208C-ND; Code_JEDEC: MS-029-FA-1; ComponentLink1Description: Spartan-3 Datasheet; ComponentLink1URL: http://www.xilinx.com/support/documentation/data_sheets/ds099.pdf; ComponentLink2Description: PQ208 Package Drawing; ComponentLink2URL: http://www.xilinx.com/support/documentation/package_specs/pq208.pdf; ComponentLink3Description: Spartan-3 Documents; ComponentLink3URL: http://www.xilinx.com/support/documentation/spartan-3.htm; ComponentLink4Description: Xilinx.com Home; ComponentLink4URL: http://www.xilinx.com
U8 = STM32F103RBT6: STM32 ARM-based 32-bit MCU with 128 Kbytes Flash, 64-pin LQFP, Industrial Temperature; Published: 30-May-2008; DatasheetVersion: rev6, Mar-2008; PackageVersion: Mar-2008; PackageReference: LQFP64; Publisher: Altium Limited; PackageDescription: 64-Pin Low-Profile Quad Flat Pack, 10 x 10 mm Body, 0.5 mm Pitch (LQFP64); ComponentLink1Description: Manufacturer Link; ComponentLink1URL: www.st.com/stm32; ComponentLink2Description: Datasheet; ComponentLink2URL: http://www.st.com/stonline/products/literature/ds/13587.pdf
U9 = FT2232HL-Reel: Dual High Speed USB To Multipurpose UART/FIFO IC, 64-pin LQFP, Tape and Reel; Manufacturer: FTDI; DatasheetVersion: ver 2.21, Jun-2012; PackageVersion: Jun-12; PackageReference: LQFP-64; PackageDescription: 64-Pin Thin Quad Flat Pack, 10 x 10 x 1.4 mm Body, 0.5 mm Pitch; PartNumber: FT2232HL-Reel; ComponentLink1Description: Manufacturer URL; ComponentLink1URL: http://www.ftdichip.com/; ComponentLink2Description: Datasheet; ComponentLink2URL: http://www.ftdichip.com/Support/Documents/DataSheets/ICs/DS_FT2232H.pdf
U10 = LM2576HVT-5.0: SIMPLE SWITCHER; 3A Step-Down Voltage Regulator; Manufacturer: National Semiconductor; PackageTopMarking: NSUZXYTT*LM2576HVT*-5.0 P+; PowerWise: N; Published: 4-Dec-2008; DatasheetVersion: Aug-2004; PackageVersion: revJ, Jan-1992; PackageReference: T05A; Publisher: Altium Limited; PackageDescription: TO-220, Molded, 5 Lead, Straight; CompType: Switcher; PartNumber: LM2576HVT-5.0; RoHS: O; PinCount: 5; DigiKeyPartNumber: LM2576HVT-5.0-ND; Code_JEDEC: TO-220-AB; ComponentLink1Description: LM2576HV Datasheet; ComponentLink1URL: http://www.national.com/ds/LM/LM2576HV.pdf; ComponentLink2Description: LM2576HV Web Page; ComponentLink2URL: http://www.national.com/pf/LM/LM2576HV.html; ComponentLink3Description: T05A Package Page; ComponentLink3URL: http://www.national.com/packaging/folders/t05a.html
U11 = 93LC46A-E/SN: 1K, 128x8-bit, 2.5V Microwire Serial EEPROM, 8-Pin SOIC 150mil, Extended Temperature; Published: 29-Jan-2009; DatasheetVersion: revG, May-2008; PackageVersion: revAW, Oct-2008; PackageReference: SOIC-SN8; Publisher: Altium Limited; PackageDescription: 8-Lead Plastic Small Outline (SN) - Narrow, 3.90mm Body [SOIC]; Code_JEDEC: MS-012; Code_IPC: SOIC127P600-8; ComponentLink1Description: Manufacturer Link; ComponentLink1URL: http://www.microchip.com; ComponentLink2Description: Datasheet; ComponentLink2URL: http://ww1.microchip.com/downloads/en/DeviceDoc/21749G.pdf; ComponentLink3Description: Packaging Specification; ComponentLink3URL: http://ww1.microchip.com/downloads/en/PackagingSpec/00049AW.pdf
U12 = XCF02SVO20C: XCF00S Series, Platform Flash In-System Programmable Configuration 3.3V PROM, 20-Pin TSOP, 2-Megabit, Commercial Grade; FirstPublished: 17-Sep-2003; LatestRevisionDate: 16-Nov-2009; LatestRevisionNote: Updated to datasheet version 2.17, Oct-2009.; DatasheetVersion: ver2.17, Oct-2009; PackageVersion: ver1.3, Dec-2008; PackageReference: VO20; Publisher: Altium Limited; PackageDescription: 20-Pin Thin Shrink Small Outline Package (VO20); Supplier 1: Digi-Key; Supplier Part Number 1: XCF02SVO20C-ND; Code_JEDEC: MO-153-AC; ComponentLink1Description: Platform Flash Datasheet; ComponentLink1URL: http://www.xilinx.com/support/documentation/data_sheets/ds123.pdf; ComponentLink2Description: VO20 Package Drawing; ComponentLink2URL: http://www.xilinx.com/support/documentation/package_specs/vo20.pdf; ComponentLink3Description: Configuration PROM Documents; ComponentLink3URL: http://www.xilinx.com/support/documentation/configuration_proms.htm; ComponentLink4Description: Xilinx.com Home; ComponentLink4URL: http://www.xilinx.com
U14 = MAX3232CPE: 3.0V TO 5.5V, Low-Power, up to 1Mbps, True RS-232 Transceiver Using Four 0.1µF External Capacitor; Published: 16-Jan-2001; LatestRevisionDate: 29-May-2009; LatestRevisionNote: Component Body Added.; DatasheetVersion: Mar-1999; PackageVersion: Aug-2000; PackageReference: PE16; Publisher: Altium Limited; PackageDescription: DIP, 16-Pin, Row Spacing 7.62 mm, Pitch 2.54 mm; Code_JEDEC: MS-001-BB; ComponentLink1Description: Manufacturer Link; ComponentLink1URL: http://www.maxim-ic.com/; ComponentLink2Description: Datasheet; ComponentLink2URL: http://pdfserv.maxim-ic.com/en/ds/MAX3222-MAX3241.pdf
VGA1 = Connector 15: Receptacle Assembly, 15-Pin, Sim Line Connector; PackageDocument: B; Positions: 15; Gender: Receptacle Header; Published: 15-Jun-2001; LatestRevisionDate: 17-Jul-2002; LatestRevisionNote: Re-released for DXP Platform.; DatasheetDocument: 24-Nov-1999; PackageReference: 788574; Publisher: Altium Limited; Orientation: Right Angle
Y1 Y2 = XTAL: Crystal Oscillator; Published: 8-Jun-2000; LatestRevisionDate: 17-Jul-2002; LatestRevisionNote: Re-released for DXP Platform.; PackageReference: R38; Publisher: Altium Limited; PackageDescription: Crystal, Thru-Hole; 2 Leads; Body 3.1 x 8.2 mm (Dia.xH)